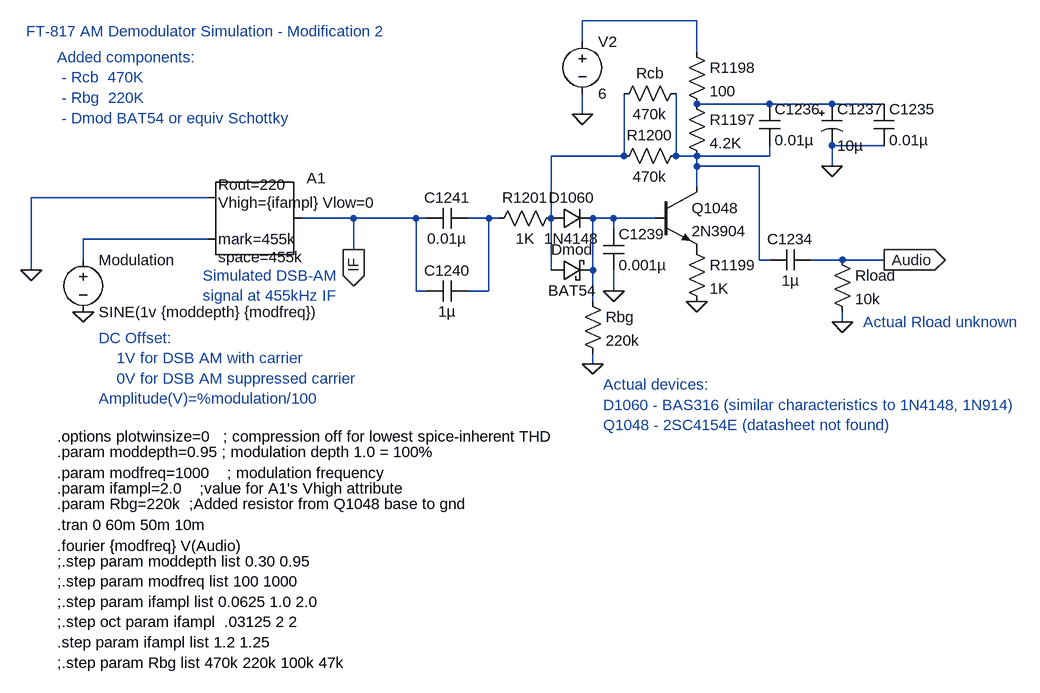
[diagram p0: schematic FT-817_AM_demodulator-Mod2-base_resistor-schottky_mod.asc]
FT-817_AM_demodulator-Mod2-base_resistor-schottky_mod.asc, the LTspice schematic file:
Version 4
SHEET 1 1212 1020
WIRE 640 32 464 32
WIRE 464 64 464 32
WIRE 640 80 640 32
WIRE 752 160 640 160
WIRE 848 160 752 160
WIRE 928 160 848 160
WIRE 464 176 464 144
WIRE 928 224 848 224
WIRE 528 240 528 144
WIRE 528 240 416 240
WIRE 608 240 608 144
WIRE 640 240 608 240
WIRE 752 240 752 224
WIRE 752 240 640 240
WIRE 640 256 640 240
WIRE 736 256 640 256
WIRE 848 256 848 224
WIRE 640 288 640 256
WIRE -112 304 -384 304
WIRE 112 336 32 336
WIRE 208 336 112 336
WIRE 224 336 208 336
WIRE 320 336 288 336
WIRE 336 336 320 336
WIRE 416 336 416 240
WIRE 512 336 480 336
WIRE 576 336 512 336
WIRE 512 352 512 336
WIRE -112 368 -304 368
WIRE 112 384 112 336
WIRE -304 400 -304 368
WIRE 736 400 736 256
WIRE 752 400 736 400
WIRE 864 400 816 400
WIRE 928 400 864 400
WIRE -384 416 -384 304
WIRE 416 416 416 336
WIRE 480 416 480 336
WIRE 208 448 208 336
WIRE 224 448 208 448
WIRE 320 448 320 336
WIRE 320 448 288 448
WIRE 512 448 512 416
WIRE 480 464 480 416
WIRE 864 496 864 480
WIRE 480 560 480 544
FLAG 512 448 0
FLAG -304 480 0
FLAG -384 416 0
FLAG 928 400 Audio
IOPIN 928 400 Out
FLAG 640 464 0
FLAG 848 256 0
FLAG 464 176 0
FLAG 864 496 0
FLAG 112 384 IF
IOPIN 112 384 Out
FLAG 480 560 0
SYMBOL SpecialFunctions\\modulate -112 304 R0
WINDOW 39 16 64 Left 0
WINDOW 40 16 92 Left 0
WINDOW 3 16 -20 Left 0
WINDOW 123 16 8 Left 0
SYMATTR SpiceLine mark=455k
SYMATTR SpiceLine2 space=455k
SYMATTR Value Rout=220
SYMATTR Value2 Vhigh={ifampl} Vlow=0
SYMATTR InstName A1
SYMBOL voltage -304 384 R0
WINDOW 123 0 0 Left 0
WINDOW 39 0 0 Left 0
SYMATTR InstName Modulation
SYMATTR Value SINE(1v {moddepth} {modfreq})
SYMBOL cap 288 320 R90
WINDOW 0 0 32 VBottom 0
WINDOW 3 32 32 VTop 0
SYMATTR InstName C1241
SYMATTR Value 0.01µ
SYMBOL diode 416 352 R270
WINDOW 0 32 32 VTop 0
WINDOW 3 0 32 VBottom 0
SYMATTR InstName D1060
SYMATTR Value 1N4148
SYMBOL cap 288 432 R90
WINDOW 0 0 32 VBottom 0
WINDOW 3 32 32 VTop 0
SYMATTR InstName C1240
SYMATTR Value 1µ
SYMBOL res 432 320 R90
WINDOW 0 0 56 VBottom 0
WINDOW 3 32 56 VTop 0
SYMATTR InstName R1201
SYMATTR Value 1K
SYMBOL npn 576 288 R0
SYMATTR InstName Q1048
SYMATTR Value 2N3904
SYMBOL cap 496 352 R0
SYMATTR InstName C1239
SYMATTR Value 0.001µ
SYMBOL res 624 368 R0
SYMATTR InstName R1199
SYMATTR Value 1K
SYMBOL res 624 224 R90
WINDOW 0 0 56 VBottom 0
WINDOW 3 32 56 VTop 0
SYMATTR InstName R1200
SYMATTR Value 470k
SYMBOL res 624 144 R0
SYMATTR InstName R1197
SYMATTR Value 4.2K
SYMBOL res 624 64 R0
SYMATTR InstName R1198
SYMATTR Value 100
SYMBOL cap 736 160 R0
SYMATTR InstName C1236
SYMATTR Value 0.01µ
SYMBOL polcap 832 160 R0
WINDOW 3 24 64 Left 0
SYMATTR Value 10µ
SYMATTR InstName C1237
SYMATTR Description Capacitor
SYMATTR Type cap
SYMATTR SpiceLine V=16 Irms=0 Rser=2.8 MTBF=0 Lser=0 mfg="AVX" pn="TAJC106M016" type="Tantalum" ppPkg=1
SYMBOL cap 912 160 R0
SYMATTR InstName C1235
SYMATTR Value 0.01µ
SYMBOL cap 816 384 R90
WINDOW 0 0 32 VBottom 0
WINDOW 3 32 32 VTop 0
SYMATTR InstName C1234
SYMATTR Value 1µ
SYMBOL voltage 464 48 R0
WINDOW 123 0 0 Left 0
WINDOW 39 0 0 Left 0
SYMATTR InstName V2
SYMATTR Value 6
SYMBOL res 848 384 R0
SYMATTR InstName Rload
SYMATTR Value 10k
SYMBOL res 464 448 R0
SYMATTR InstName Rbg
SYMATTR Value 220k
SYMBOL res 624 128 R90
WINDOW 0 0 56 VBottom 0
WINDOW 3 32 56 VTop 0
SYMATTR InstName Rcb
SYMATTR Value 470k
SYMBOL schottky 416 432 R270
WINDOW 0 32 32 VTop 0
WINDOW 3 0 32 VBottom 0
SYMATTR InstName Dmod
SYMATTR Value BAT54
SYMATTR Description Diode
SYMATTR Type diode
TEXT -344 840 Left 0 !.fourier {modfreq} V(Audio)
TEXT -344 808 Left 0 !.tran 0 60m 50m 10m
TEXT -344 672 Left 0 !.options plotwinsize=0   ; compression off for lowest spice-inherent THD
TEXT -392 48 Left 0 ;FT-817 AM Demodulator Simulation - Modification 2
TEXT -120 424 Left 0 ;Simulated DSB-AM \nsignal at 455kHz IF
TEXT 496 592 Left 0 ;Actual devices:\nD1060 - BAS316 (similar characteristics to 1N4148, 1N914)\nQ1048 - 2SC4154E (datasheet not found)
TEXT 896 496 Left 0 ;Actual Rload unknown
TEXT -280 520 Left 0 ;DC Offset: \n	1V for DSB AM with carrier\n	0V for DSB AM suppressed carrier\nAmplitude(V)=%modulation/100
TEXT -344 696 Left 0 !.param moddepth=0.95 ; modulation depth 1.0 = 100%
TEXT -344 864 Left 0 !;.step param moddepth list 0.30 0.95\n;.step param modfreq list 100 1000\n;.step param ifampl list 0.0625 1.0 2.0\n;.step oct param ifampl  .03125 2 2\n.step param ifampl list 1.2 1.25\n;.step param Rbg list 470k 220k 100k 47k
TEXT -344 776 Left 0 !.param Rbg=220k  ;Added resistor from Q1048 base to gnd
TEXT -344 752 Left 0 !.param ifampl=2.0    ;value for A1's Vhigh attribute
TEXT -344 728 Left 0 !.param modfreq=1000    ; modulation frequency
TEXT -344 88 Left 0 ;Added components:\n - Rcb  470K\n - Rbg  220K\n - Dmod BAT54 or equiv Schottky

The netlist it stands for:
* FT-817_AM_demodulator-Mod2-base_resistor-schottky_mod.asc
A1 0 N007 0 0 0 0 IF 0 MODULATOR Rout=220 Vhigh={ifampl} Vlow=0 mark=455k space=455k
V§Modulation N007 0 SINE(1v {moddepth} {modfreq})
C1241 N005 IF 0.01µ
D1060 N003 N006 1N4148
C1240 N005 IF 1µ
R1201 N003 N005 1K
Q1048 N004 N006 P001 0 2N3904
C1239 N006 0 0.001µ
R1199 P001 0 1K
R1200 N004 N003 470k
R1197 N002 N004 4.2K
R1198 N001 N002 100
C1236 N002 N004 0.01µ
C1237 N002 0 10µ V=16 Irms=0 Rser=2.8 MTBF=0 Lser=0 mfg="AVX" pn="TAJC106M016" type="Tantalum" ppPkg=1
C1235 N002 0 0.01µ
C1234 Audio N004 1µ
V2 N001 0 6
Rload Audio 0 10k
Rbg N006 0 220k
Rcb N004 N003 470k
Dmod N003 N006 BAT54
.model D D
.lib standard.dio
.model NPN NPN
.model PNP PNP
.lib standard.bjt
.fourier {modfreq} V(Audio)
.tran 0 60m 50m 10m
.options plotwinsize=0   ; compression off for lowest spice-inherent THD
* FT-817 AM Demodulator Simulation - Modification 2
* Simulated DSB-AM
* signal at 455kHz IF
* Actual devices:
* D1060 - BAS316 (similar characteristics to 1N4148, 1N914)
* Q1048 - 2SC4154E (datasheet not found)
* Actual Rload unknown
* DC Offset:
* 	1V for DSB AM with carrier
* 	0V for DSB AM suppressed carrier
* Amplitude(V)=%modulation/100
.param moddepth=0.95 ; modulation depth 1.0 = 100%
;.step param moddepth list 0.30 0.95
;.step param modfreq list 100 1000
;.step param ifampl list 0.0625 1.0 2.0
;.step oct param ifampl  .03125 2 2
.step param ifampl list 1.2 1.25
;.step param Rbg list 470k 220k 100k 47k
.param Rbg=220k  ;Added resistor from Q1048 base to gnd
.param ifampl=2.0    ;value for A1's Vhigh attribute
.param modfreq=1000    ; modulation frequency
* Added components:
*  - Rcb  470K
*  - Rbg  220K
*  - Dmod BAT54 or equiv Schottky
.backanno
.end